# EAGLE design ESP8266-new (EAGLE 7.2.0)
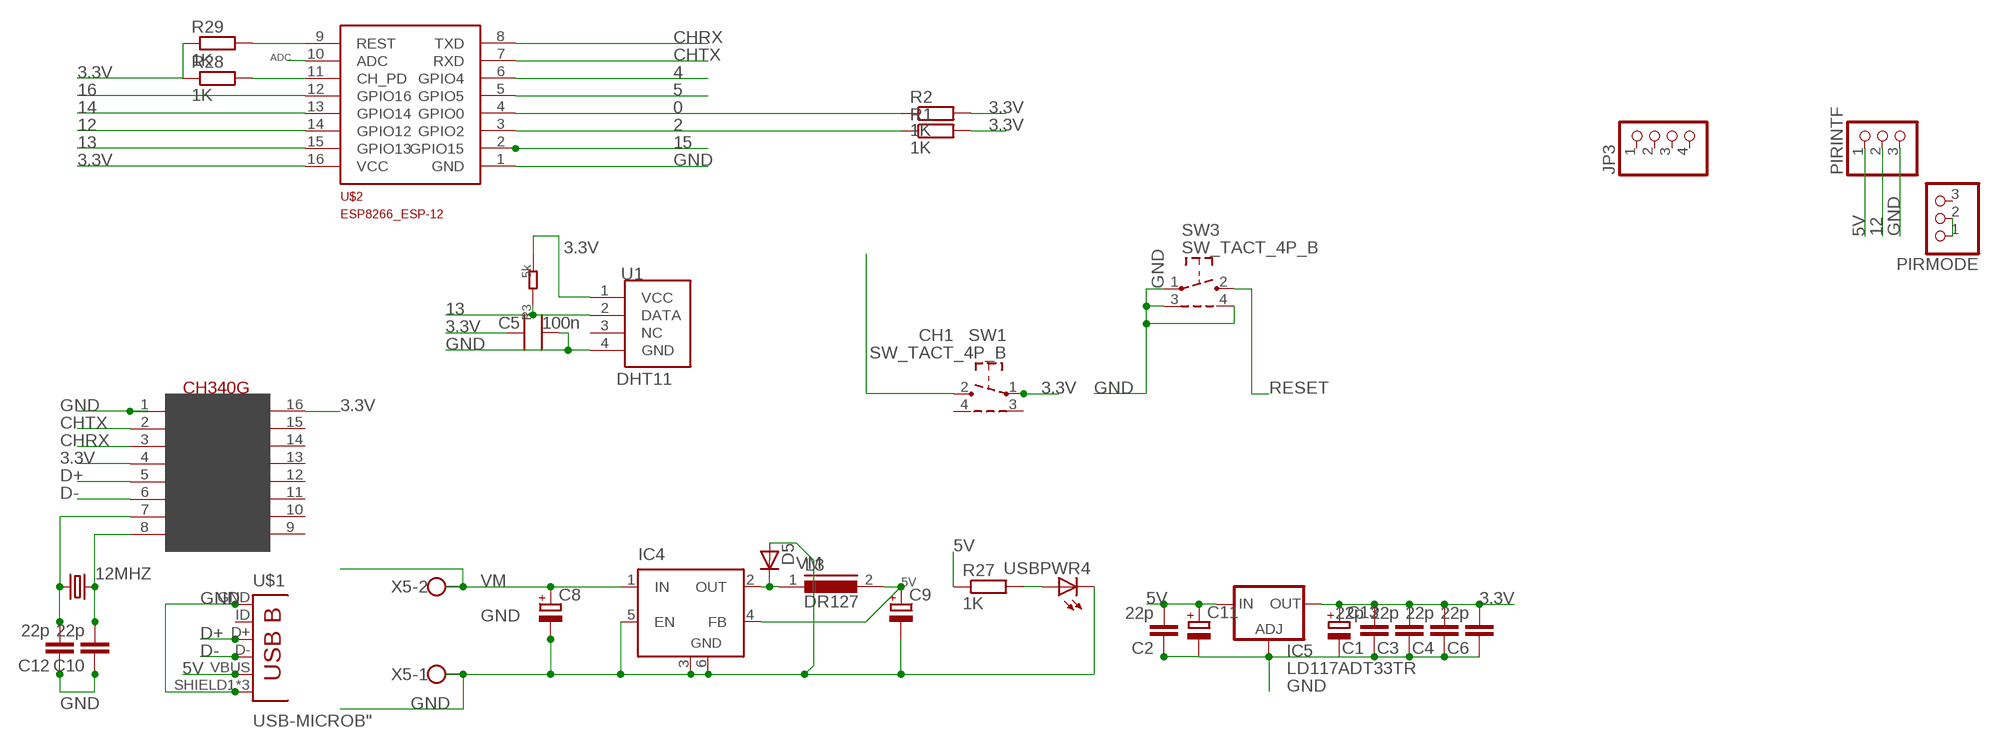
[diagram p0: schematic, sheet 1]

## Parts
12MHZ  CRYSTALHC49UP  [HC49UP]
C1  22p  C-EUC1206  [C1206]
C2  22p  C-EUC1206  [C1206]
C3  22p  C-EUC1206  [C1206]
C4  22p  C-EUC1206  [C1206]
C5  100n  C0603  [0603]
C6  22p  C-EUC1206  [C1206]
C8  CPOL-EUE2.5-7  [E2,5-7]
C9  CPOL-EUE2.5-7  [E2,5-7]
C10  22p  C-EUC1206  [C1206]
C11  CPOL-EUC  [PANASONIC_C]
C12  22p  C-EUC1206  [C1206]
C13  CPOL-EUC  [PANASONIC_C]
D5  D-SOD-87  [SOD87]
IC4  LM2596S  [TO263-5]
IC5  LD117ADT33TR  [DPACK]
JP3  PINHD-1X4/90  [1X04/90]
L3  DR127  [DR127]
PIRINTF  PINHD-1X3  [1X03]
PIRMODE  PINHD-1X3  [1X03]
R1  1K  R-EU_M1206  [M1206]
R2  1K  R-EU_M1206  [M1206]
R3  5k  R0603  [0603]
R27  1K  R-EU_M1206  [M1206]
R28  1K  R-EU_M1206  [M1206]
R29  1K  R-EU_M1206  [M1206]
SW1  SW_TACT_4P_B  [SW_TACT_STANDARD_RIGHT_ANGLE]
SW3  SW_TACT_4P_B  [SW_TACT_STANDARD_RIGHT_ANGLE]
U1  DHT11  [DHT11]
U$1  USB-MICROB"  [USB-B-MICRO-SMD_V03]
U$2  ESP8266_ESP-12  [ESP8266-ESP12]
U$4  CH340G  [SOIC16]
USBPWR4  LEDCHIP-LED0805  [CHIP-LED0805]
X5  W237-102  [W237-102]

## Nets
0: R2.1 SW1.2 U$2.4(GPIO0)
2: R1.1 U$2.3(GPIO2)
3.3V: C1.2 C3.2 C4.2 C5.1 C6.2 C13.+ IC5.4(OUT) R1.2 R2.2 R3.2 R28.1 R29.1 SW1.1 U1.1(VCC) U$2.16(VCC) U$4.4(V3) U$4.16(VCC)
4: U$2.6(GPIO4)
5: U$2.5(GPIO5)
5V: C2.2 C9.+ C11.+ IC4.4(FB) IC5.3(IN) L3.2 PIRINTF.1 R27.1 U$1.VBUS
12: PIRINTF.2 U$2.14(GPIO12)
13: R3.1 U1.2(DATA) U$2.15(GPIO13)
14: U$2.13(GPIO14)
15: U$2.2(GPIO15)
16: U$2.12(GPIO16)
ADC: U$2.10(ADC)
CHRX: U$2.8(TXD) U$4.3(RX)
CHTX: U$2.7(RXD) U$4.2(TX)
D+: U$1.D+ U$4.5(D+)
D-: U$1.D- U$4.6(D-)
GND: C1.1 C2.1 C3.1 C4.1 C5.2 C6.1 C8.- C9.- C10.1 C11.- C12.1 C13.- D5.2(A) IC4.3(GND) IC4.5(EN) IC4.6(GND) IC5.1(ADJ) PIRINTF.3 SW3.1 SW3.3 SW3.4 U1.4(GND) U$1.GND U$1.SHIELD1(SHIELD) U$1.SHIELD2(SHIELD) U$1.SHIELD3(SHIELD) U$2.1(GND) U$4.1(GND) USBPWR4.C X5.1
N$9: D5.1(C) IC4.2(OUT) L3.1
N$10: R27.2 USBPWR4.A
N$11: PIRMODE.1 PIRMODE.2
N$12: 12MHZ.1 C12.2 U$4.7(XI)
N$13: 12MHZ.2 C10.2 U$4.8(XO)
N$18: R28.2 U$2.11(CH_PD)
RESET: R29.2 SW3.2 U$2.9(REST)
VM: C8.+ IC4.1(IN) X5.2
Unconnected: JP3.1 JP3.2 JP3.3 JP3.4 PIRMODE.3 SW1.3 SW1.4 U1.3(NC) U$1.ID(USBID) U$4.9(CTS) U$4.10(DSR) U$4.11(RI) U$4.12(DCD) U$4.13(DTR) U$4.14(RTS) U$4.15(RS232)

## Library data of the parts
12MHZ = crystal:CRYSTAL: CRYSTAL; OC_FARNELL: unknown; OC_NEWARK: unknown
C1-C4 C6 C10 C12 = rcl:C-EU: CAPACITOR, European symbol
C5 = CPT_SMD:C0603; C0603: 100N
C8 C9 = resistor:CPOL-EU: POLARIZED CAPACITOR, European symbol
C11 C13 = rcl:CPOL-EU: POLARIZED CAPACITOR, European symbol
D5 = semicon-smd-ipc:D-: DIODE unfilled
IC4 = linear:LM2596S: STEP-DOWN VOLTAGE REGULATOR
IC5 = v-reg:LD117A?*: Low drop fixed and adjustable positive voltage regulators 1 A Source: http://www.st.com/stonline/products/literature/ds/7194/ld1117axx.pdf
JP3 = pinhead:PINHD-1X4: PIN HEADER
L3 = inductors:DR127: High Power Density, High Efficiency, Shielded Inductors Source: coiltronics_dr_series.pdf
PIRINTF PIRMODE = pinhead:PINHD-1X3: PIN HEADER
R1 R2 R27-R29 = rcl:R-EU_: RESISTOR, European symbol
R3 = CPT_SMD:R0603
SW1 SW3 = dp_devices:SW_TACT_4P_B
U1 = Sensors:DHT11
U$1 = SparkFun-Connectors:USB-MICROB; PROD_ID: CONN-11752
U$2 = ESP8266-ESP12:ESP8266_ESP-12: ESP8266 ESP-12 Discussion about pins here: http://www.esp8266.com/viewtopic.php?f=13&t=1429
U$4 = usb-serial:CH340G
USBPWR4 = RepRapjr:LED: LED OSRAM: - CHIPLED LG R971, LG N971, LY N971, LG Q971, LY Q971, LO R971, LY R971 LH N974, LH R974 LS Q976, LO Q976, LY Q976 LO Q996 - Hyper CHIPLED LW Q18S LB Q993, LB Q99A, LB R99A - SideLED LS A670, LO A670, LY A670, LG A670, LP A670 LB A673, LV A673, LT A673, LW A673 LH A674 LY A675 LS A676, LA A676, LO A676, LY A676, LW A676 LS A679, LY A679, LG A679 - Hyper Micro SIDELED® LS Y876, LA Y876, LO Y876, LY Y876 LT Y87S - SmartLED LW L88C, LW L88S LB L89C, LB L89S, LG L890 LS L89K, LO L89K, LY L89K LS L896, LA L896, LO L896, LY L896 - TOPLED LS T670, LO T670, LY T670, LG T670, LP T670 LSG T670, LSP T670, LSY T670, LOP T670, LYG T670 LG T671, LOG T671, LSG T671 LB T673, LV T673, LT T673, LW T673 LH T674 LS T676, LA T676, LO T676, LY T676, LB T676, LH T676, LSB T676, LW T676 LB T67C, LV T67C, LT T67C, LS T67K, LO T67K, LY T67K, LW E67C LS E67B, LA E67B, LO E67B, LY E67B, LB E67C, LV E67C, LT E67C LW T67C LS T679, LY T679, LG T679 LS T770, LO T770, LY T770, LG T770, LP T770 LB T773, LV T773, LT T773, LW T773 LH T774 LS E675, LA E675, LY E675, LS T675 LS T776, LA T776, LO T776, LY T776, LB T776 LHGB T686 LT T68C, LB T68C - Hyper Mini TOPLED® LB M676 - Mini TOPLED Santana® LG M470 LS M47K, LO M47K, LY M47K Source: http://www.osram.convergy.de LUXEON: - LUMILED® LXK2-PW12-R00, LXK2-PW12-S00, LXK2-PW14-U00, LXK2-PW14-V00 LXK2-PM12-R00, LXK2-PM12-S00, LXK2-PM14-U00 LXK2-PE12-Q00, LXK2-PE12-R00, LXK2-PE12-S00, LXK2-PE14-T00, LXK2-PE14-U00 LXK2-PB12-K00, LXK2-PB12-L00, LXK2-PB12-M00, LXK2-PB14-N00, LXK2-PB14-P00, LXK2-PB14-Q00 LXK2-PR12-L00, LXK2-PR12-M00, LXK2-PR14-Q00, LXK2-PR14-R00 LXK2-PD12-Q00, LXK2-PD12-R00, LXK2-PD12-S00 LXK2-PH12-R00, LXK2-PH12-S00 LXK2-PL12-P00, LXK2-PL12-Q00, LXK2-PL12-R00 Source: www.luxeon.com KINGBRIGHT: KA-3528ASYC Source: www.kingbright.com
X5 = con-wago-500:W237-102: WAGO SCREW CLAMP; MPN: 237-102; OC_FARNELL: unknown; OC_NEWARK: 70K9898

## Board
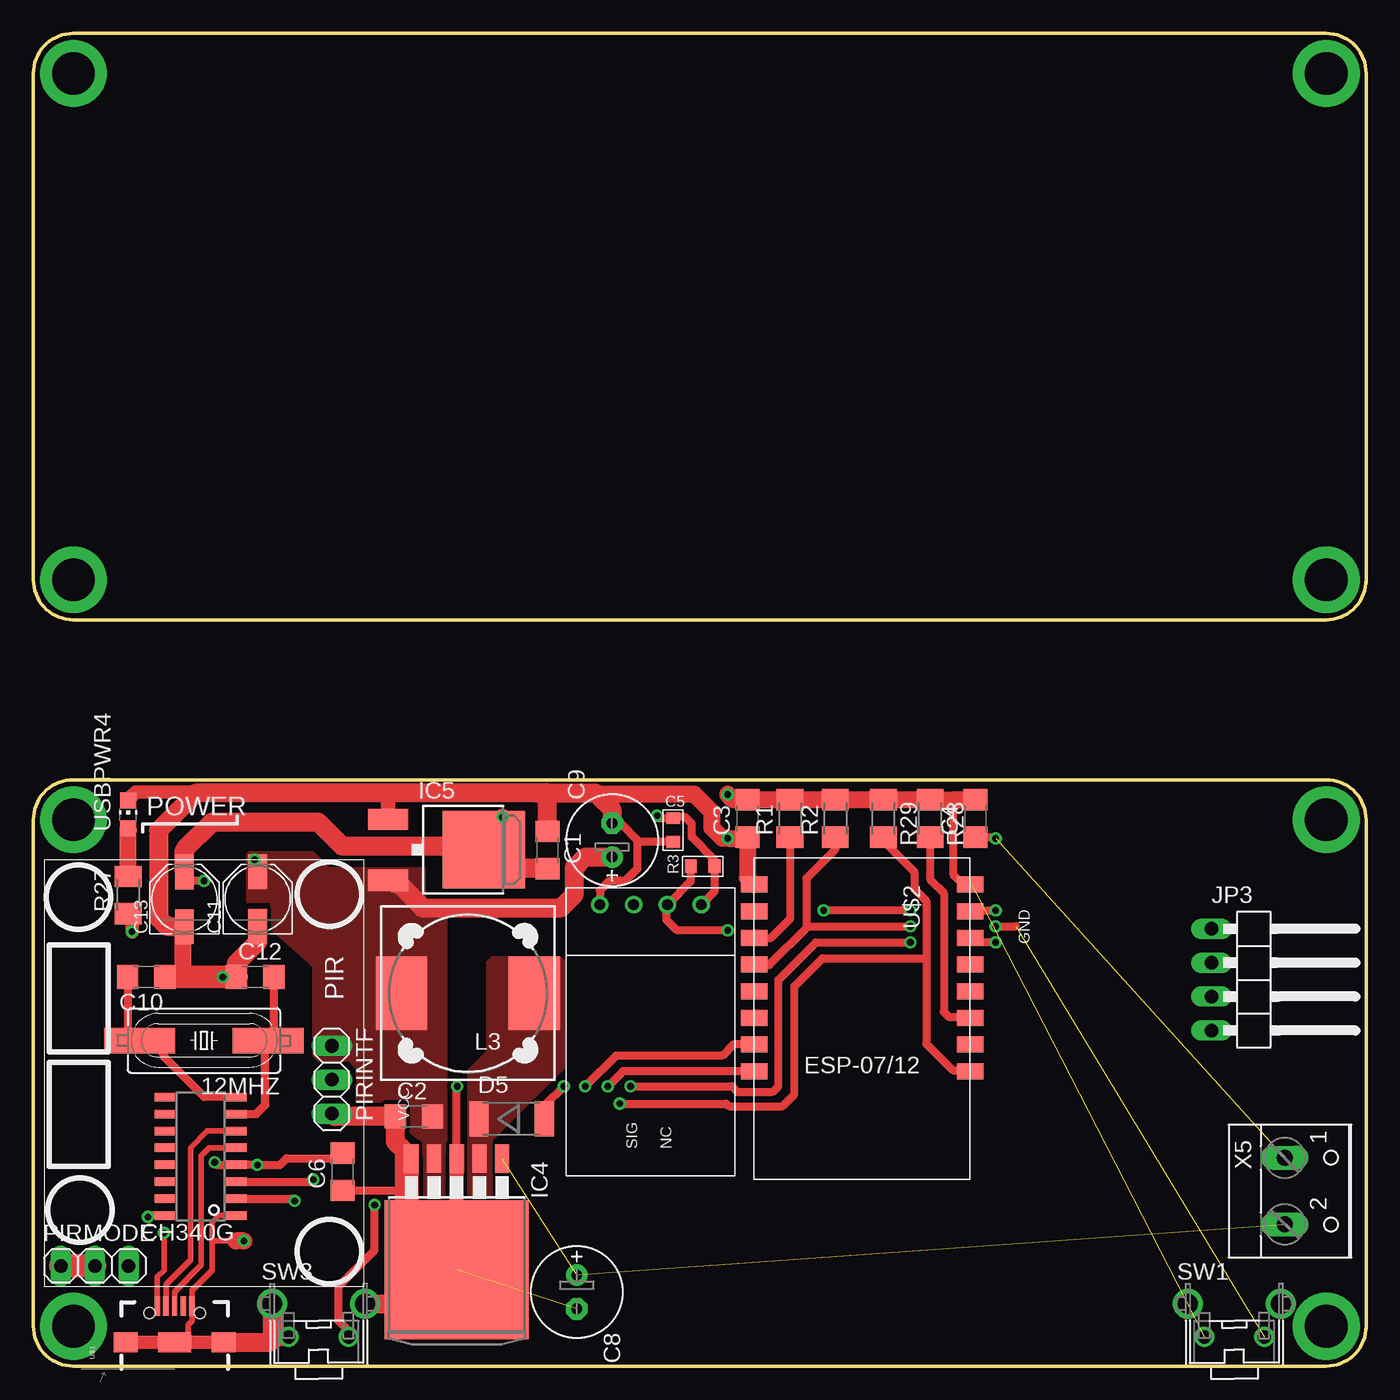
[diagram p1: board, top side]
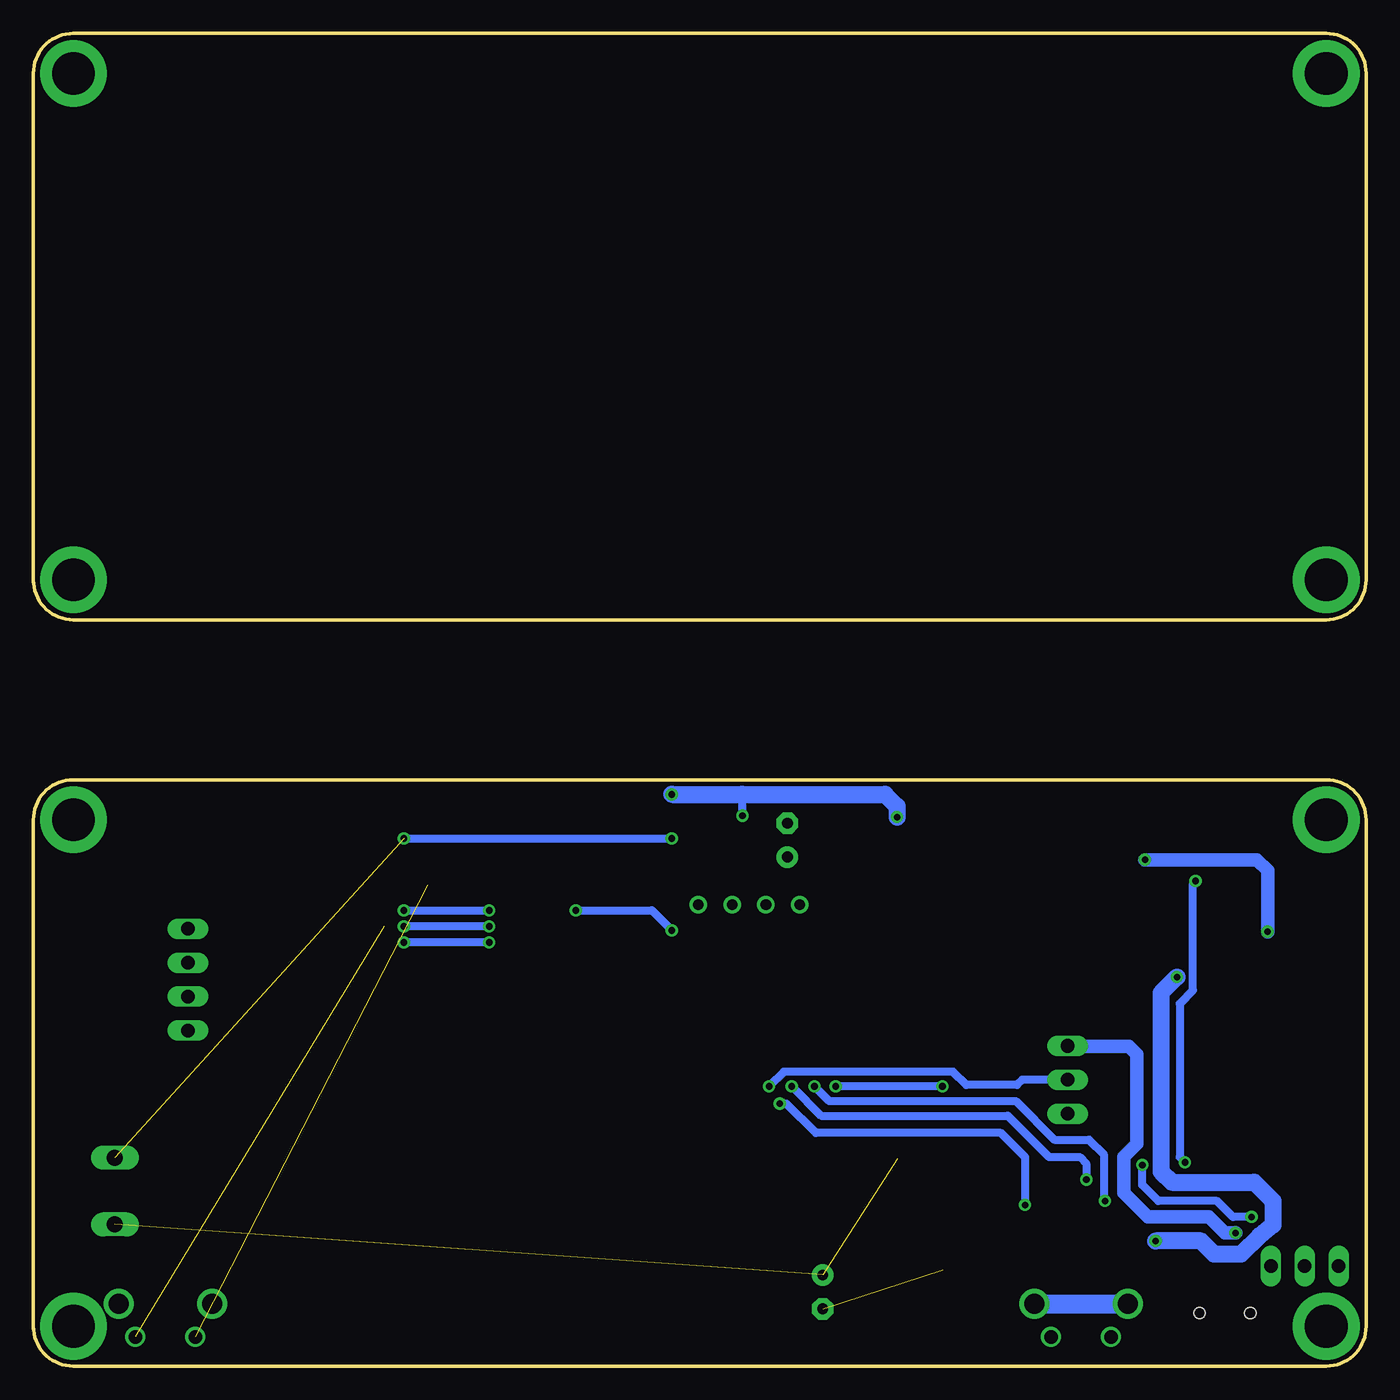
[diagram p2: board, bottom side, seen from below]

Size 100 x 100 mm. Coordinates in mm from the lower left corner, seen from the top.
Outline: 100,2.8 100,3
Outline: 100,3 100,41 arc90 97,44 3,44 arc90 0,41 0,3 arc90 3,0 97,0 arc90 100,3
Outline: 100,58.8 100,59
Outline: 100,59 100,97 arc90 97,100 3,100 arc90 0,97 0,59 arc90 3,56 97,56 arc90 100,59
Copper layers (1*16): Top 0.035mm / dielectric 1.5mm / Bottom 0.035mm
Design rules "default": minimum track width 10mil, minimum drill 24mil, track to track 8mil, track to pad 8mil, pad to pad 8mil, via to via 8mil, smd to smd 8mil, copper to edge 40mil, drill to drill 8mil, minimum pad ring 10mil, minimum via ring 8mil, stop-mask expansion 4mil, vias tented up to drill 0mil, thermal gap 10mil

### Footprints (pad centres in the part's own frame; a part is rotated, then mirrored left to right if it is on the bottom)
HC49UP = smd 5.334 x 1.93: 1 -4.826,0; 2 4.826,0
C1206 = smd 1.6 x 1.8: 1 -1.4,0; 2 1.4,0
0603 = smd 0.889 x 1.016: 1 -0.889,0; 2 0.889,0
E2,5-7 = drill 0.813 pad 1.6: + -1.27,0 | drill 0.813 pad 1.6 octagon: - 1.27,0
PANASONIC_C = smd 2.6 x 1.4: + 2.05,0; - -2.05,0
SOD87 = smd 1.45 x 2.6: 1 -2.445,0; 2 2.445,0
TO263-5 = smd 1.067 x 2.159: 1 -3.404,-5.791; 2 -1.702,-5.791; 3 0,-5.791; 4 1.702,-5.791; 5 3.404,-5.791 | smd 10.8 x 10.41: 6 0,2.54
DPACK = smd 1.6 x 3: 1 -2.28,-4.8; 3 2.28,-4.8 | smd 5.8 x 6.2: 4 0,2.38
1X04/90 = drill 1.016 long: 1 -3.81,-3.81; 2 -1.27,-3.81; 3 1.27,-3.81; 4 3.81,-3.81
DR127 = smd 3.85 x 5.5: 1 -4.975,0; 2 4.975,0
1X03 = drill 1.016 long: 1 -2.54,0; 2 0,0; 3 2.54,0
M1206 = smd 1.6 x 2: 1 -1.4,0; 2 1.4,0
SW_TACT_STANDARD_RIGHT_ANGLE = drill 1: 1 -2.25,0; 2 2.25,0 | drill 1.5: 3 -3.5,2.5; 4 3.5,2.5
DHT11 = drill 0.8: 1 -3.81,-3.81; 2 -1.27,-3.81; 3 1.27,-3.81; 4 3.81,-3.81
USB-B-MICRO-SMD_V03 = smd 1.45 x 0.4: D+ 2.725,0; D- 2.725,0.65; GND 2.725,-1.3; ID 2.725,-0.65; VBUS 2.725,1.3 | smd 1.5 x 1.8: SHIELD1 0,3.685; SHIELD2 0,-3.685 | smd 1.5 x 2.5: SHIELD3 0,0 | hole 0.85: 2.2,1.9; 2.2,-1.9
ESP8266-ESP12 = smd 2 x 1.2: 1 16.2,2; 2 16.2,4; 3 16.2,6; 4 16.2,8; 5 16.2,10; 6 16.2,12; 7 16.2,14; 8 16.2,16; 9 0,16; 10 0,14; 11 0,12; 12 0,10; 13 0,8; 14 0,6; 15 0,4; 16 0,2
SOIC16 = smd 0.635 x 1.524: 1 -4.445,-2.695; 2 -3.175,-2.695; 3 -1.905,-2.695; 4 -0.635,-2.695; 5 0.635,-2.695; 6 1.905,-2.695; 7 3.175,-2.695; 8 4.445,-2.695; 9 4.445,2.695; 10 3.175,2.695; 11 1.905,2.695; 12 0.635,2.695; 13 -0.635,2.695; 14 -1.905,2.695; 15 -3.175,2.695; 16 -4.445,2.695
CHIP-LED0805 = smd 1.2 x 1.2: A 0,-1.05; C 0,1.05
W237-102 = drill 1.194 long: 1 -2.5,-1.27; 2 2.5,-1.27

### Placement (x,y rotation side)
12MHZ  12.8,24.43 180 top
C1  38.57,38.72 270 top
C2  28.56,18.73 0 top
C3  53.57,41.1 90 top
C4  70.67,41.1 90 top
C5  48,40.22 270 top
C6  23.2,14.6 90 top
C8  40.77,5.57 270 top
C9  43.43,39.47 90 top
C10  8.48,29.2 180 top
C11  16.83,35.05 90 top
C12  16.64,29.2 0 top
C13  11.33,35.03 90 top
D5  35.89,18.56 0 top
IC4  31.77,9.78 180 top
IC5  31.42,38.74 270 top
JP3  92.2,29 270 top
L3  32.61,27.98 180 top
PIRINTF  22.39,21.49 270 top
PIRMODE  4.61,7.52 0 top
R1  56.77,41.1 90 top
R2  60.17,41.1 90 top
R3  50.21,37.5 0 top
R27  7.12,35.34 90 top
R28  67.28,41.1 270 top
R29  63.78,41.1 270 top
SW1  90.1,2.2 0 top
SW3  21.4,2.2 0 top
U1  46.3,30.81 180 top
U$1  10.6,1.8 90 top
U$2  70.28,38.13 180 top
U$4  12.55,15.75 90 top
USBPWR4  7.1,41.38 0 top
X5  95.15,13.14 270 top

### Tracks (layer width: path | path; a pad name or v marks a point on that pad's centre or on a via)
0  (via drill 0.5)  (1 unrouted)
  Top 0.61: R2.1 60.17,38.77 58,36.6 58,32.9 | 58,32.9 55.2,30.1 54.11,30.1 U$2.4 | 58,32.9 58.1,33 v65.8,33 | v72.2,33 73.7,33
  Bottom 0.61: v65.8,33 v72.2,33
2
  Top 0.61: R1.1 56.77,33.57 55.3,32.1 54.11,32.1 U$2.3
3.3V  (via drill 0.5)  (1 unrouted)
  Top 0.406: 15.36,15.1 U$4.4 15.13,15.1 | 11.91,36.4 C13.+
  Top 0.61: U$4.16 8.71,11.3 v8.6,11.2 | 15.36,15.1 v16.8,15.1 18.5,15.1 19,15.6 22.8,15.6 C6.2 | v13.6,15.3 13.8,15.1 15.13,15.1 | v12.8,36.4 11.91,36.4 | 69.1,42.5 69,42.4 69,36.9 69.8,36.1 70.25,36.1 U$2.16 70.37,36.13 70.4,36.1 | v46.8,41.3 46.99,41.11 C5.1 48.09,41.2 48.9,41.2 49.4,40.7 49.4,39.7 51.1,38 R3.2 51.1,35.6 U1.1
  Top 1.27: 69.1,42.5 C4.2 R28.1 R29.1 R2.2 R1.2 C3.2 52.5,42.5 v52.1,42.9 | v35.2,41.2 35.2,38.74
  Top 1.422: C13.+ 11.33,38.73 13.4,40.8 21.4,40.8 23.2,39 32.6,39 32.86,38.74 IC5.4 35.2,38.74 35.26,38.74 36.6,37.4 37.89,37.4 C1.2
  Bottom 0.61: v8.6,11.2 10,11.2 11.2,12.4 15.6,12.4 16.8,13.6 v16.8,15.1 | v13.6,15.3 14,15.7 14,27.2 13,28.2 13,36.2 v12.8,36.4 | v46.8,41.3 46.8,42.9
  Bottom 1.27: v52.1,42.9 46.8,42.9 36.1,42.9 35.2,42 v35.2,41.2
5V  (via drill 0.5)
  Top 0.406: v9.8,10 9.8,7.2 9.3,6.7 U$1.VBUS
  Top 1.016: C11.+ 16.83,37.77 v16.6,38 | v7.4,32.6 7.4,33.76 R27.1
  Top 1.422: IC5.3 27.54,36.06 29.2,34.4 39.6,34.4 40.6,35.4 40.6,37.4 41.4,38.2 C9.+
  Bottom 1.016: v9.8,10 10.6,10 11.8,11.2 16.4,11.2 18.2,13 18.2,15.7 17.2,16.7 17.2,23.4 17.8,24 22.36,24 PIRINTF.1 | v16.6,38 8.2,38 7.4,37.2 v7.4,32.6
  pour Top (isolate 0.305, no thermals): 29.4,37.4 22.2,37.4 21,38.6 16.2,38.6 16,38.4 16,34.8 17.8,34.8 17.8,32.8 21,30 21,23.3 21.4,22.9 23.7,22.9 24.2,22.4 24.2,19.8 28,19.8 28.2,19.6 28.2,17.6 29.2,16.8 29.2,12.8 31,12.8 31,34.6 29.4,34.6
12  (via drill 0.5)
  Top 0.61: v44.8,21 52.4,21 52.8,20.6 55.5,20.6 55.9,21 55.9,29 58.7,31.8 v65.8,31.8 | v72.2,31.8 70.51,31.8 U$2.14
  Bottom 0.61: PIRINTF.2 25.81,21.49 26.2,21.1 30,21.1 31,22.1 43.7,22.1 v44.8,21 | v65.8,31.8 v72.2,31.8
13  (via drill 0.5)
  Top 0.61: U$2.15 70.37,34.13 70.4,34.1 70.5,34.2 v72.2,34.2 | R3.1 49.32,36.37 U1.2 47.5,34.54 47.5,33.5 48.3,32.7 v52.1,32.7 | v65.8,34.2 v59.3,34.2
  Bottom 0.61: v52.1,32.7 53.6,34.2 v59.3,34.2 | v72.2,34.2 v65.8,34.2
CHRX  (via drill 0.5)
  Top 0.61: U$4.3 20.84,13.85 v21,14 | U$2.8 44.23,22.13 v43.1,21
  Bottom 0.61: v43.1,21 40.9,18.8 26.9,18.8 23.8,15.7 21.5,15.7 21,15.2 v21,14
CHTX  (via drill 0.5)
  Top 0.61: U$4.2 19.38,12.57 v19.6,12.4 | U$2.7 52.53,24.13 51.7,23.3 43.7,23.3 v41.4,21
  Bottom 0.61: v41.4,21 40.3,19.9 26.3,19.9 23.4,17 20.8,17 19.7,15.9 19.7,12.5 v19.6,12.4
D+
  Top 0.406: U$4.5 13.19,16.39 12.6,15.8 12.6,7.6 10.6,5.6 U$1.D+
D-
  Top 0.406: U$4.6 13.05,17.66 11.8,16.4 11.8,8 9.95,6.15 U$1.D-
GND  (via drill 0.5)  (2 unrouted)
  Top 0.406: 14.6,1.8 11.6,1.8 11.6,3.1 11.9,3.4 U$1.GND 11.9,5.7 13.4,7.2 13.4,9.4 | U$4.1 13.9,11.3 13.4,10.8 13.4,9.4 | 13.4,9.4 v15.8,9.4
  Top 0.61: IC4.3 31.77,20.97 v31.8,21 | D5.2 38.4,18.62 38.4,19.6 v39.8,21 39.9,20.9 | C6.1 27.6,13.2 27.8,13 | C4.1 72.1,39.7 v72.2,39.6 | 53.47,39.6 C3.1 | C9.- 44.06,40.74 45.3,39.5 45.3,39.1 | 45.3,39.1 45.3,37.3 44.4,36.4 43.2,36.4 42.5,35.7 U1.4 | C5.2 45.53,39.33 45.3,39.1
  Top 1.016: U$1.SHIELD1 U$1.SHIELD3 11.6,1.8 U$1.SHIELD2 | USBPWR4.C 7.3,42.7 7.7,43.1 12.4,43.1 12.2,43
  Top 1.1: IC4.5 28.37,10.24 IC4.6 IC4.3 | IC5.1 26.62,42.98 26.2,43
  Top 1.27: v14.2,29.2 C12.1 15.2,29.24 | v15.8,9.4 15.2,9.4 | 10.21,33 11.2,33 11.2,29.4 11.4,29.2 | C3.1 53.57,36.64 U$2.1 | 53.47,39.6 v52.1,39.6 51.7,39.6 50.9,40.4 50.9,41.6 49.6,42.9 42.6,42.9 42.45,42.75
  Top 1.422: C11.- 16.83,31.79 16.8,31.8 15.24,30.24 C12.1 | 37.8,43 26.2,43 12.2,43 9.4,40.2 9.4,33.6 10,33 10.21,33 C13.- | PIRINTF.3 22.61,18.73 C2.1 27.16,16.84 27.8,16.2 27.8,13 27.8,8.8 29.2,7.4 31.61,7.4 IC4.6 29.23,4.7 SW3.4 | 14.6,1.8 17.8,1.8 17.9,1.9 17.9,2.2 | SW3.3 17.9,2.2 | SW3.1 17.9,2.2 | 37.8,43 42.2,43 42.45,42.75 43.4,41.8 43.4,40.77 C9.- | C1.1 38.57,43.03 37.8,43
  Top 1.676: C10.1 11.4,29.2 C12.1
  Bottom 0.61: v31.8,21 v39.8,21 | v72.2,39.6 v52.1,39.6
  Bottom 1.27: v14.2,29.2 15.4,28 15.4,14.6 14.6,13.8 8.4,13.8 7,12.4 7,10.6 8,9.8 9.4,8.4 11.4,8.4 12.4,9.4 v15.8,9.4
  Bottom 1.422: SW3.4 SW3.3
N$1  (via drill 3.2 pad 5)
  other vias: 3,3
N$2  (via drill 3.2 pad 5)
  other vias: 3,41
N$3  (via drill 3.2 pad 5)
  other vias: 97,41
N$4  (via drill 3.2 pad 5)
  other vias: 97,3
N$6  (via drill 3.2 pad 5)
  other vias: 3,59
N$7  (via drill 3.2 pad 5)
  other vias: 3,97
N$8  (via drill 3.2 pad 5)
  other vias: 97,97
N$9
  pour Top (no thermals): 32.6,12.8 32.6,22.2 34,23.6 34,30.3 34.4,30.7 39.5,30.7 39.8,30.4 39.8,22.4 34.4,17 34.4,12.8
N$10
  Top 1.27: R27.2 7.12,40.21 USBPWR4.A
N$11
  Top 1.778: PIRMODE.2 PIRMODE.1
N$12
  Top 0.406: 17.4,24.4 12MHZ.1 18.04,25.04
  Top 0.61: U$4.7 16.73,18.93 17.4,19.6 17.4,24.4 | C12.2 18.04,25.04
N$13
  Top 0.406: 7.8,24.4 12MHZ.2
  Top 0.61: U$4.8 12.8,20.2 9.8,23.2 9.8,23.4 8.8,24.4 7.8,24.4 | C10.2 7.08,25.12 12MHZ.2
N$14  (via drill 3.2 pad 5)
  other vias: 97,59
N$18
  Top 0.61: U$2.11 70.21,26.2 68.7,26.2 68.3,26.6 68.3,35.5 67.28,36.52 R28.2
RESET  (via drill 0.5)
  Top 0.61: R29.2 63.78,39.42 66.1,37.1 66.1,35.8 67,34.9 67,30.7 | U$2.9 70.21,22.2 69,22.2 67,24.2 67,30.7 | SW3.2 23.65,2.65 22.9,3.4 22.9,6 25.6,8.7 v25.6,12.1 | v44,19.7 52,19.7 52.2,19.5 56.2,19.5 57.1,20.4 57.1,28.5 59.2,30.6 66.9,30.6 67,30.7
  Bottom 0.61: v44,19.7 43.5,19.7 41.3,17.5 27.4,17.5 25.6,15.7 v25.6,12.1
VM  (2 unrouted)

### Text on the board
tPlace: POWER | GND | PIR | VCC | SIG | NC